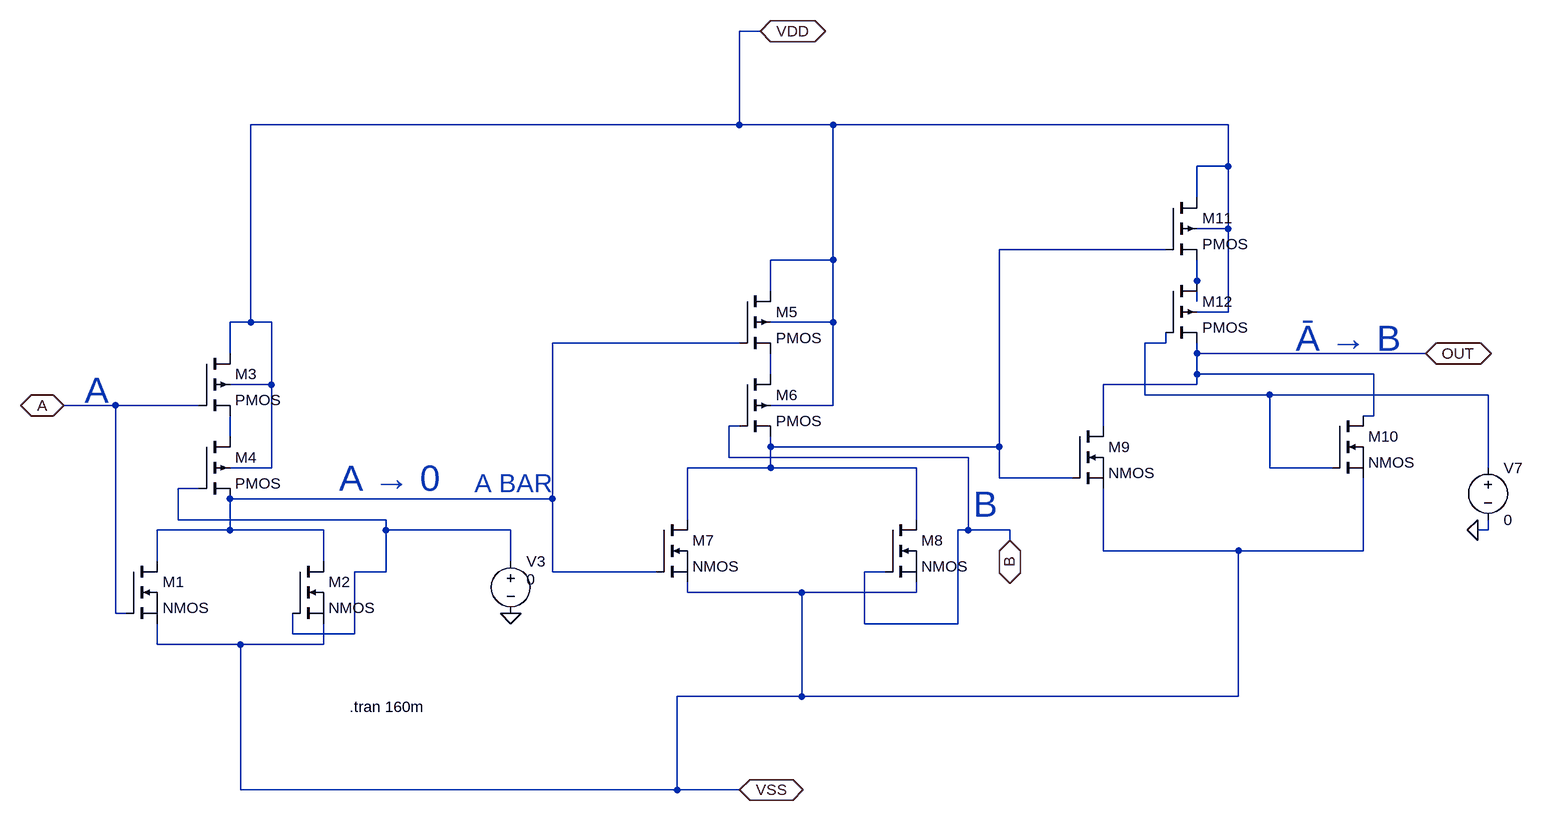
[diagram p0: schematic implygate.asc]
implygate.asc, the LTspice schematic file:
Version 4
SHEET 1 1756 1144
WIRE -944 -992 -976 -992
WIRE -976 -848 -976 -992
WIRE -976 -848 -1728 -848
WIRE -832 -848 -976 -848
WIRE -224 -848 -832 -848
WIRE -224 -784 -224 -848
WIRE -224 -784 -272 -784
WIRE -272 -736 -272 -784
WIRE -224 -688 -224 -784
WIRE -224 -688 -272 -688
WIRE -320 -656 -576 -656
WIRE -832 -640 -832 -848
WIRE -832 -640 -928 -640
WIRE -272 -608 -272 -640
WIRE -928 -592 -928 -640
WIRE -272 -576 -272 -608
WIRE -224 -560 -224 -688
WIRE -224 -560 -272 -560
WIRE -1728 -544 -1728 -848
WIRE -1728 -544 -1760 -544
WIRE -1696 -544 -1728 -544
WIRE -832 -544 -832 -640
WIRE -832 -544 -928 -544
WIRE -976 -512 -1264 -512
WIRE -320 -512 -320 -528
WIRE -320 -512 -352 -512
WIRE -1760 -496 -1760 -544
WIRE -272 -496 -272 -512
WIRE 80 -496 -272 -496
WIRE -928 -464 -928 -496
WIRE -272 -464 -272 -496
WIRE 0 -464 -272 -464
WIRE -1696 -448 -1696 -544
WIRE -1696 -448 -1760 -448
WIRE -272 -448 -272 -464
WIRE -272 -448 -416 -448
WIRE -352 -432 -352 -512
WIRE -160 -432 -352 -432
WIRE 176 -432 -160 -432
WIRE -1936 -416 -2016 -416
WIRE -1808 -416 -1936 -416
WIRE -832 -416 -832 -544
WIRE -832 -416 -928 -416
WIRE 0 -400 0 -464
WIRE 0 -400 -16 -400
WIRE -976 -384 -992 -384
WIRE -416 -384 -416 -448
WIRE -1760 -368 -1760 -400
WIRE -928 -352 -928 -368
WIRE -576 -352 -576 -656
WIRE -576 -352 -928 -352
WIRE -992 -336 -992 -384
WIRE -624 -336 -992 -336
WIRE -1696 -320 -1696 -448
WIRE -1696 -320 -1760 -320
WIRE -928 -320 -928 -352
WIRE -928 -320 -1056 -320
WIRE -704 -320 -928 -320
WIRE -160 -320 -160 -432
WIRE -64 -320 -160 -320
WIRE 176 -320 176 -432
WIRE -576 -304 -576 -352
WIRE -464 -304 -576 -304
WIRE -1808 -288 -1840 -288
WIRE -1264 -272 -1264 -512
WIRE -1264 -272 -1760 -272
WIRE -1840 -240 -1840 -288
WIRE -1520 -240 -1840 -240
WIRE -1056 -240 -1056 -320
WIRE -704 -240 -704 -320
WIRE -1760 -224 -1760 -272
WIRE -1760 -224 -1872 -224
WIRE -1616 -224 -1760 -224
WIRE -1520 -224 -1520 -240
WIRE -1328 -224 -1520 -224
WIRE -624 -224 -624 -336
WIRE -624 -224 -640 -224
WIRE -560 -224 -624 -224
WIRE 176 -224 176 -240
WIRE 176 -224 160 -224
WIRE -560 -208 -560 -224
WIRE -416 -192 -416 -288
WIRE -208 -192 -416 -192
WIRE -16 -192 -16 -304
WIRE -16 -192 -208 -192
WIRE -1872 -176 -1872 -224
WIRE -1616 -176 -1616 -224
WIRE -1328 -176 -1328 -224
WIRE -1520 -160 -1520 -224
WIRE -1520 -160 -1568 -160
WIRE -1264 -160 -1264 -272
WIRE -1104 -160 -1264 -160
WIRE -752 -160 -784 -160
WIRE -1056 -128 -1056 -144
WIRE -880 -128 -1056 -128
WIRE -704 -128 -704 -144
WIRE -704 -128 -880 -128
WIRE -1936 -96 -1936 -416
WIRE -1920 -96 -1936 -96
WIRE -784 -80 -784 -160
WIRE -640 -80 -640 -224
WIRE -640 -80 -784 -80
WIRE -1664 -64 -1664 -96
WIRE -1568 -64 -1568 -160
WIRE -1568 -64 -1664 -64
WIRE -1872 -48 -1872 -80
WIRE -1744 -48 -1872 -48
WIRE -1616 -48 -1616 -80
WIRE -1616 -48 -1744 -48
WIRE -880 32 -880 -128
WIRE -880 32 -1072 32
WIRE -208 32 -208 -192
WIRE -208 32 -880 32
WIRE -1744 176 -1744 -48
WIRE -1072 176 -1072 32
WIRE -1072 176 -1744 176
WIRE -976 176 -1072 176
FLAG -1328 -96 0
FLAG 160 -224 0
FLAG 80 -496 OUT
IOPIN 80 -496 BiDir
FLAG -944 -992 VDD
IOPIN -944 -992 BiDir
FLAG -976 176 VSS
IOPIN -976 176 BiDir
FLAG -2016 -416 A
IOPIN -2016 -416 BiDir
FLAG -560 -208 B
IOPIN -560 -208 BiDir
SYMBOL nmos -1920 -176 R0
SYMATTR InstName M1
SYMBOL nmos -1664 -176 R0
SYMATTR InstName M2
SYMBOL pmos4 -1808 -496 R0
SYMATTR InstName M3
SYMBOL pmos4 -1808 -368 R0
SYMATTR InstName M4
SYMBOL voltage -1328 -192 R0
WINDOW 3 24 44 Left 2
WINDOW 123 0 0 Left 0
WINDOW 39 0 0 Left 0
SYMATTR Value 0
SYMATTR InstName V3
SYMBOL pmos4 -976 -592 R0
SYMATTR InstName M5
SYMBOL pmos4 -976 -464 R0
SYMATTR InstName M6
SYMBOL nmos -1104 -240 R0
SYMATTR InstName M7
SYMBOL nmos -752 -240 R0
SYMATTR InstName M8
SYMBOL nmos -464 -384 R0
SYMATTR InstName M9
SYMBOL nmos -64 -400 R0
SYMATTR InstName M10
SYMBOL voltage 176 -336 R0
WINDOW 123 0 0 Left 0
WINDOW 39 0 0 Left 0
SYMATTR InstName V7
SYMATTR Value 0
SYMBOL pmos4 -320 -736 R0
SYMATTR InstName M11
SYMBOL pmos4 -320 -608 R0
SYMATTR InstName M12
TEXT -1984 -440 Left 5 ;A
TEXT -1592 -304 Left 5 ;A → 0
TEXT -1384 -296 Left 4 ;A BAR
TEXT -616 -264 Left 5 ;B
TEXT -120 -520 Left 5 ;Ā → B
TEXT -1576 48 Left 2 !.tran 160m

The netlist it stands for:
* implygate.asc
M1 N003 A VSS VSS NMOS
M2 N003 N007 VSS VSS NMOS
M3 VDD A N006 VDD PMOS
M4 N006 N007 N003 VDD PMOS
V3 N007 0 0
M5 VDD N003 N005 VDD PMOS
M6 N005 B N001 VDD PMOS
M7 N001 N003 VSS VSS NMOS
M8 N001 B VSS VSS NMOS
M9 OUT N001 VSS VSS NMOS
M10 OUT N004 VSS VSS NMOS
V7 N004 0 0
M11 VDD N001 N002 VDD PMOS
M12 N002 N004 OUT VDD PMOS
.model NMOS NMOS
.model PMOS PMOS
.lib standard.mos
* A
* A → 0
* A BAR
* B
* Ā → B
.tran 160m
.backanno
.end